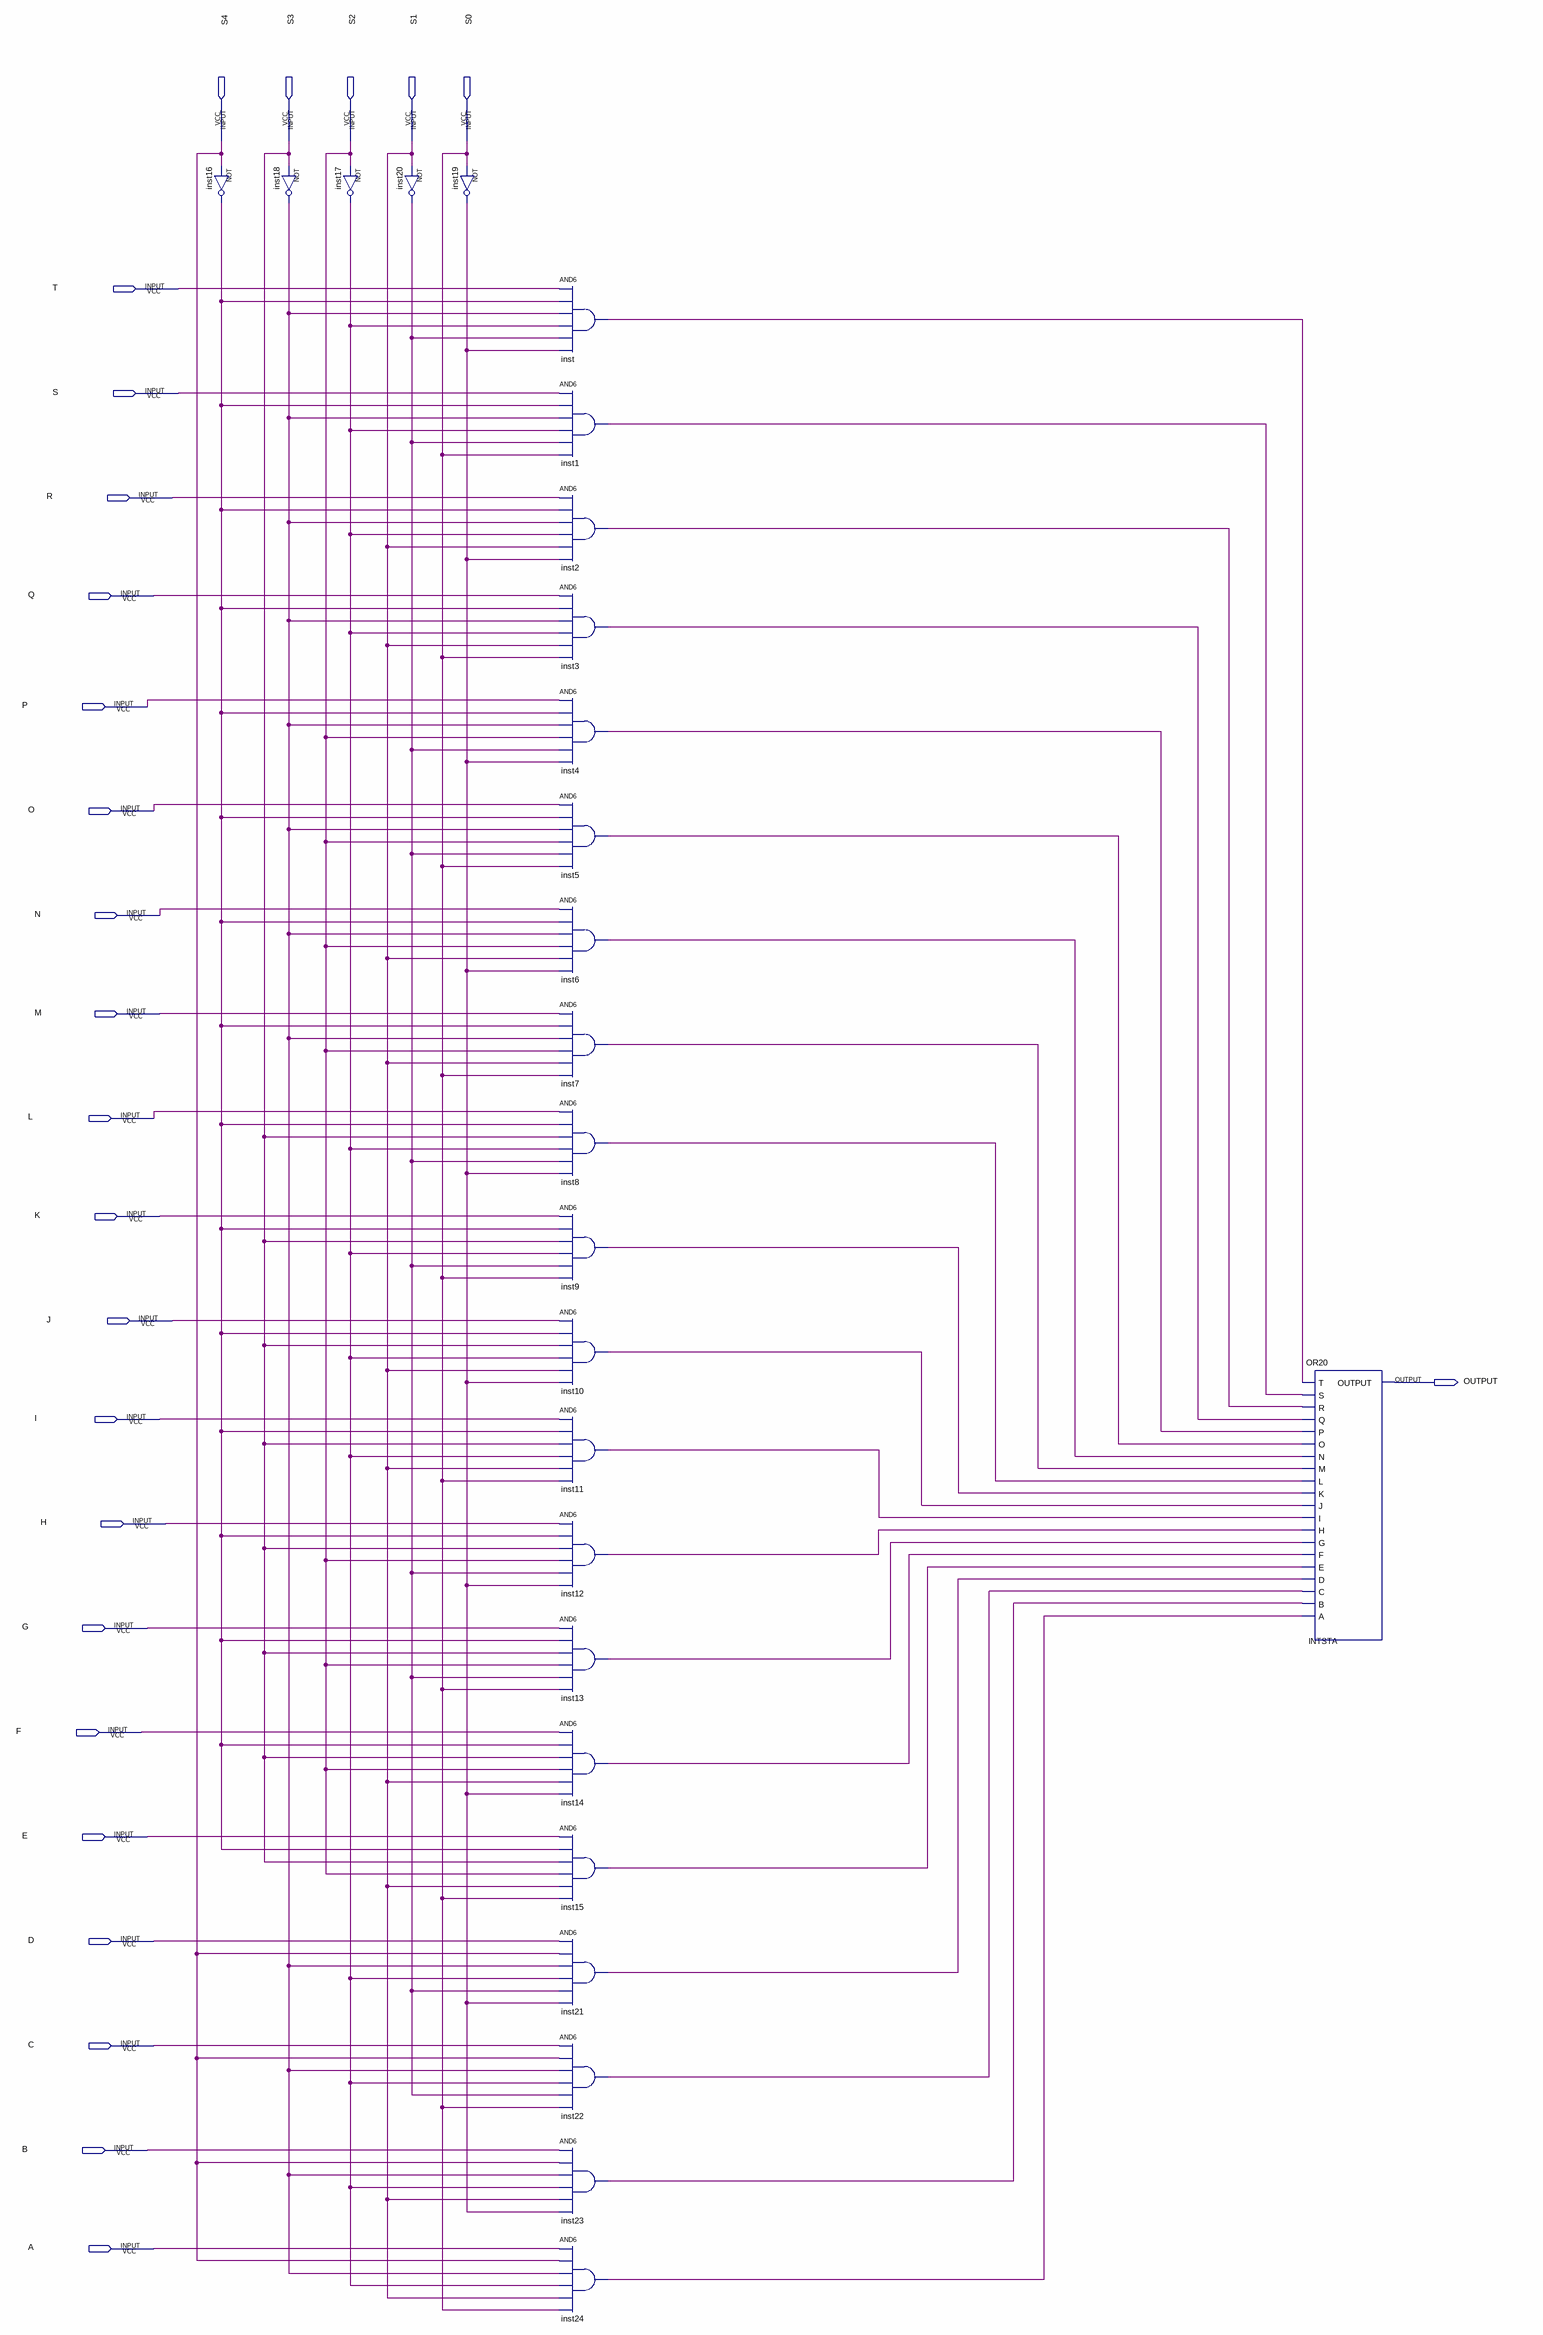
[diagram p0: schematic sheet]
// Quartus schematic MyMux.bdf as structural Verilog: 26 symbols, 26 pins
module MyMux (
  input  S4,
  input  S3,
  input  S2,
  input  S1,
  input  S0,
  input  T,
  input  S,
  input  R,
  input  Q,
  input  P,
  input  O,
  input  N,
  input  M,
  input  L,
  input  K,
  input  J,
  input  I,
  input  H,
  input  G,
  input  F,
  input  E,
  input  D,
  input  C,
  input  B,
  input  A,
  output OUTPUT
);

  wire inst1_out, inst2_out, inst3_out, inst4_out, inst5_out, inst6_out, inst7_out, inst8_out, inst9_out,
       inst10_out, inst11_out, inst12_out, inst13_out, inst14_out, inst15_out, inst16_out, inst17_out,
       inst18_out, inst19_out, inst20_out, inst21_out, inst22_out, inst23_out, inst24_out, inst_out;

  not inst16 (inst16_out, S4);
  not inst18 (inst18_out, S3);
  not inst17 (inst17_out, S2);
  not inst20 (inst20_out, S1);
  not inst19 (inst19_out, S0);
  and inst (inst_out, T, inst16_out, inst18_out, inst17_out, inst20_out, inst19_out);
  and inst1 (inst1_out, S, inst16_out, inst18_out, inst17_out, inst20_out, S0);
  and inst2 (inst2_out, R, inst16_out, inst18_out, inst17_out, S1, inst19_out);
  and inst3 (inst3_out, Q, inst16_out, inst18_out, inst17_out, S1, S0);
  and inst4 (inst4_out, P, inst16_out, inst18_out, S2, inst20_out, inst19_out);
  and inst5 (inst5_out, O, inst16_out, inst18_out, S2, inst20_out, S0);
  and inst6 (inst6_out, N, inst16_out, inst18_out, S2, S1, inst19_out);
  and inst7 (inst7_out, M, inst16_out, inst18_out, S2, S1, S0);
  and inst8 (inst8_out, L, inst16_out, S3, inst17_out, inst20_out, inst19_out);
  and inst9 (inst9_out, K, inst16_out, S3, inst17_out, inst20_out, S0);
  and inst10 (inst10_out, J, inst16_out, S3, inst17_out, S1, inst19_out);
  and inst11 (inst11_out, I, inst16_out, S3, inst17_out, S1, S0);
  and inst12 (inst12_out, H, inst16_out, S3, S2, inst20_out, inst19_out);
  and inst13 (inst13_out, G, inst16_out, S3, S2, inst20_out, S0);
  and inst14 (inst14_out, F, inst16_out, S3, S2, S1, inst19_out);
  and inst15 (inst15_out, E, inst16_out, S3, S2, S1, S0);
  and inst21 (inst21_out, D, S4, inst18_out, inst17_out, inst20_out, inst19_out);
  and inst22 (inst22_out, C, S4, inst18_out, inst17_out, inst20_out, S0);
  and inst23 (inst23_out, B, S4, inst18_out, inst17_out, S1, inst19_out);
  and inst24 (inst24_out, A, S4, inst18_out, inst17_out, S1, S0);
  OR20 INTSTA (
    .T(inst_out), .S(inst1_out), .R(inst2_out), .Q(inst3_out), .P(inst4_out), .O(inst5_out), .N(inst6_out),
    .M(inst7_out), .L(inst8_out), .K(inst9_out), .J(inst10_out), .I(inst11_out), .H(inst12_out),
    .G(inst13_out), .F(inst14_out), .E(inst15_out), .D(inst21_out), .C(inst22_out), .B(inst23_out),
    .A(inst24_out), .OUTPUT(OUTPUT));
endmodule
